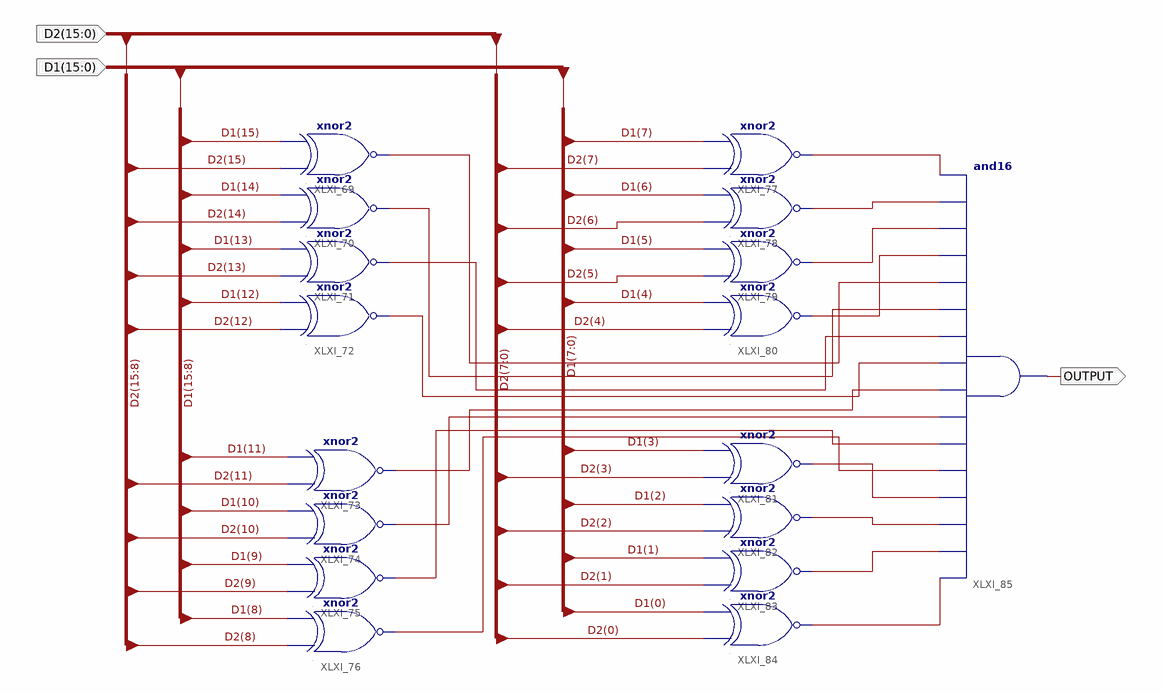
[diagram p0: schematic sheet 1]
// Xilinx ISE schematic compare16.sch (spartan6) as structural Verilog: 17 symbols, 3 ports
module compare16 (
  input  [15:0] D1,
  input  [15:0] D2,
  output OUTPUT
);

  wire XLXN_47, XLXN_48, XLXN_49, XLXN_50, XLXN_51, XLXN_52, XLXN_53, XLXN_54, XLXN_56, XLXN_57, XLXN_58,
       XLXN_59, XLXN_60, XLXN_61, XLXN_63, XLXN_64;

  xnor XLXI_69 (XLXN_56, D2[15], D1[15]);
  xnor XLXI_70 (XLXN_57, D2[14], D1[14]);
  xnor XLXI_71 (XLXN_58, D2[13], D1[13]);
  xnor XLXI_72 (XLXN_59, D2[12], D1[12]);
  xnor XLXI_73 (XLXN_64, D2[11], D1[11]);
  xnor XLXI_74 (XLXN_63, D2[10], D1[10]);
  xnor XLXI_75 (XLXN_61, D2[9], D1[9]);
  xnor XLXI_76 (XLXN_60, D2[8], D1[8]);
  xnor XLXI_77 (XLXN_47, D2[7], D1[7]);
  xnor XLXI_78 (XLXN_48, D2[6], D1[6]);
  xnor XLXI_79 (XLXN_49, D2[5], D1[5]);
  xnor XLXI_80 (XLXN_50, D2[4], D1[4]);
  xnor XLXI_81 (XLXN_54, D2[3], D1[3]);
  xnor XLXI_82 (XLXN_53, D2[2], D1[2]);
  xnor XLXI_83 (XLXN_52, D2[1], D1[1]);
  xnor XLXI_84 (XLXN_51, D2[0], D1[0]);
  and XLXI_85 (OUTPUT, XLXN_51, XLXN_52, XLXN_53, XLXN_54, XLXN_60, XLXN_61, XLXN_63, XLXN_64, XLXN_59, XLXN_58, XLXN_57, XLXN_56, XLXN_50, XLXN_49, XLXN_48, XLXN_47);
endmodule
